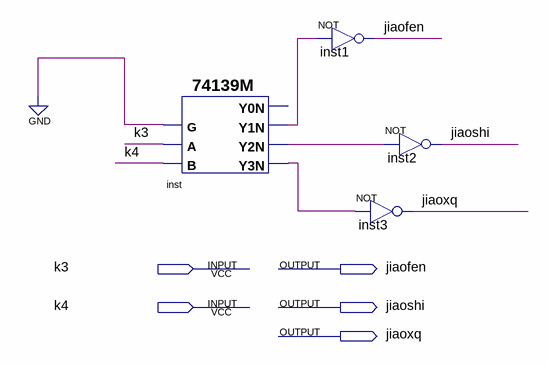
[diagram p0: schematic sheet]
// Quartus schematic jiaoxqfuyong.bdf as structural Verilog: 4 symbols, 5 pins
module jiaoxqfuyong (
  input  k3,
  input  k4,
  output jiaofen,
  output jiaoshi,
  output jiaoxq
);

  wire inst_y1n, inst_y2n, inst_y3n;

  \74139M  inst (.B(k4), .A(k3), .G(1'b0), .Y3N(inst_y3n), .Y2N(inst_y2n), .Y1N(inst_y1n));  // open: Y0N
  not inst1 (jiaofen, inst_y1n);
  not inst3 (jiaoxq, inst_y3n);
  not inst2 (jiaoshi, inst_y2n);
endmodule
